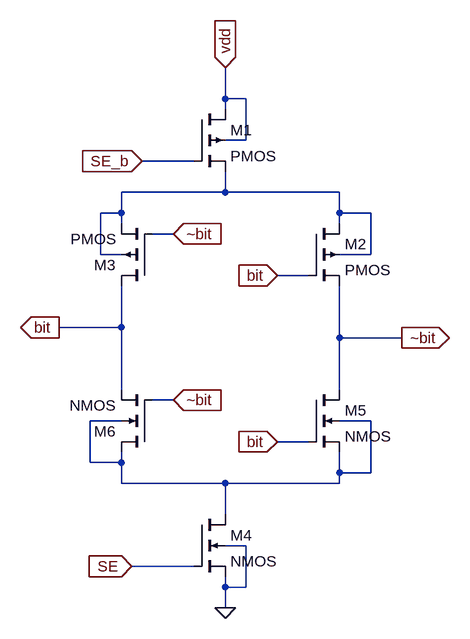
[diagram p0: schematic se.asc]
se.asc, the LTspice schematic file:
Version 4
SHEET 1 880 868
WIRE 208 64 208 16
WIRE 240 64 208 64
WIRE 208 80 208 64
WIRE 240 128 240 64
WIRE 240 128 208 128
WIRE 160 160 80 160
WIRE 208 208 208 176
WIRE 208 208 48 208
WIRE 384 208 208 208
WIRE 48 240 48 208
WIRE 48 240 16 240
WIRE 384 240 384 208
WIRE 432 240 384 240
WIRE 48 256 48 240
WIRE 384 256 384 240
WIRE 128 272 96 272
WIRE 16 304 16 240
WIRE 48 304 16 304
WIRE 432 304 432 240
WIRE 432 304 384 304
WIRE 336 336 288 336
WIRE 48 416 48 352
WIRE 48 416 -48 416
WIRE 384 432 384 352
WIRE 480 432 384 432
WIRE 48 512 48 416
WIRE 384 512 384 432
WIRE 128 528 96 528
WIRE 48 560 0 560
WIRE 432 560 384 560
WIRE 336 592 288 592
WIRE 0 624 0 560
WIRE 48 624 48 608
WIRE 48 624 0 624
WIRE 384 640 384 608
WIRE 432 640 432 560
WIRE 432 640 384 640
WIRE 48 656 48 624
WIRE 208 656 48 656
WIRE 384 656 384 640
WIRE 384 656 208 656
WIRE 208 704 208 656
WIRE 240 752 208 752
WIRE 160 784 64 784
WIRE 208 816 208 800
WIRE 240 816 240 752
WIRE 240 816 208 816
WIRE 208 848 208 816
FLAG 208 16 vdd
IOPIN 208 16 In
FLAG 80 160 SE_b
IOPIN 80 160 In
FLAG 288 336 bit
IOPIN 288 336 In
FLAG 288 592 bit
IOPIN 288 592 In
FLAG 128 272 ~bit
IOPIN 128 272 In
FLAG 128 528 ~bit
IOPIN 128 528 In
FLAG -48 416 bit
IOPIN -48 416 Out
FLAG 480 432 ~bit
IOPIN 480 432 Out
FLAG 208 848 0
FLAG 64 784 SE
IOPIN 64 784 In
SYMBOL pmos4 160 80 R0
SYMATTR InstName M1
SYMATTR Value2 l=32n w=640n
SYMBOL pmos4 336 256 R0
SYMATTR InstName M2
SYMATTR Value2 l=32n w=64n
SYMBOL pmos4 96 352 R180
SYMATTR InstName M3
SYMATTR Value2 l=32n w=64n
SYMBOL nmos4 160 704 R0
SYMATTR InstName M4
SYMATTR Value2 l=32n w=640n
SYMBOL nmos4 336 512 R0
SYMATTR InstName M5
SYMATTR Value2 l=32n w=640n
SYMBOL nmos4 96 608 R180
SYMATTR InstName M6
SYMATTR Value2 l=32n w=640n

The netlist it stands for:
* se.asc
M1 vdd SE_b N001 vdd PMOS l=32n w=640n
M2 N001 bit ~bit N001 PMOS l=32n w=64n
M3 bit ~bit N001 N001 PMOS l=32n w=64n
M4 N002 SE 0 0 NMOS l=32n w=640n
M5 ~bit bit N002 N002 NMOS l=32n w=640n
M6 N002 ~bit bit N002 NMOS l=32n w=640n
.model NMOS NMOS
.model PMOS PMOS
.lib standard.mos
.backanno
.end